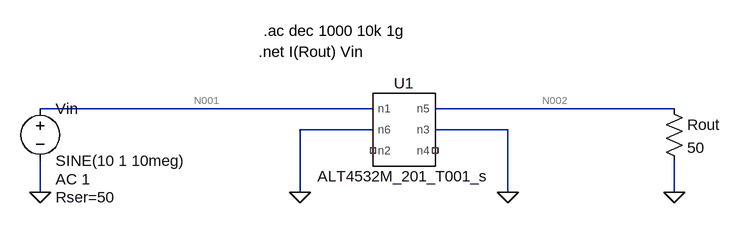
[diagram p0: schematic ETH_trafo_S21.asc]
ETH_trafo_S21.asc, the LTspice schematic file:
Version 4
SHEET 1 880 680
WIRE -64 112 -576 112
WIRE 400 112 32 112
WIRE -64 144 -176 144
WIRE 144 144 32 144
WIRE -576 240 -576 192
WIRE -176 240 -176 144
WIRE 144 240 144 144
WIRE 400 240 400 192
FLAG -576 240 0
FLAG 400 240 0
FLAG -176 240 0
FLAG 144 240 0
DATAFLAG 288 112 ""
SYMBOL voltage -576 96 R0
WINDOW 123 24 124 Left 2
WINDOW 39 24 152 Left 2
SYMATTR Value2 AC 1
SYMATTR SpiceLine Rser=50
SYMATTR InstName Vin
SYMATTR Value SINE(10 1 10meg)
SYMBOL res 384 96 R0
SYMATTR InstName Rout
SYMATTR Value 50
SYMBOL AutoGenerated\\ALT4532M_201_T001_s -16 144 R0
SYMATTR InstName U1
TEXT -240 24 Left 2 !.net I(Rout) Vin
TEXT -232 -8 Left 2 !.ac dec 1000 10k 1g

The netlist it stands for:
* ETH_trafo_S21.asc
Vin N001 0 SINE(10 1 10meg) AC 1 Rser=50
Rout N002 0 50
XU1 N001 NC_01 0 NC_02 N002 0 ALT4532M_201_T001_s  ; pins n1 n2 n3 n4 n5 n6
.net I(Rout) Vin
.ac dec 1000 10k 1g
.lib alt4532m_201_t001_s.mod.cir
.backanno
.end

* Results of the author's LTspice run, read from the files saved beside the schematic
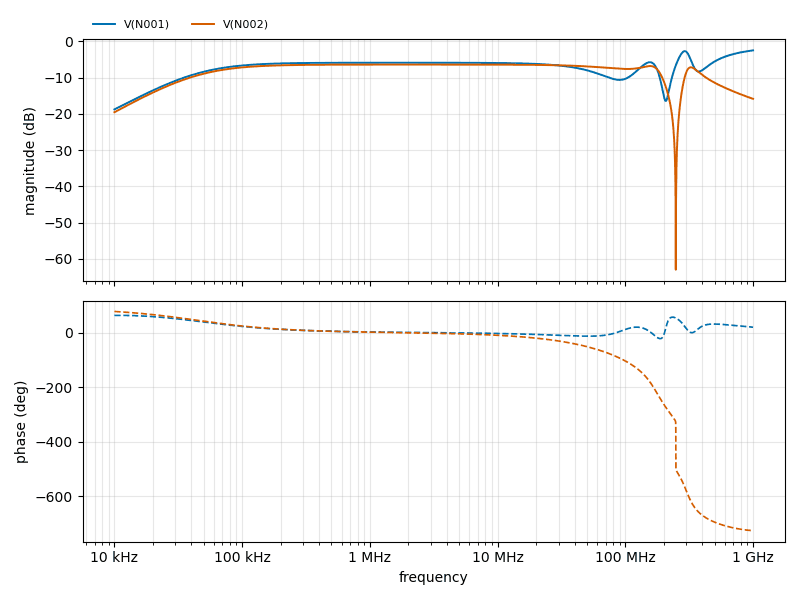
[diagram p1: AC Analysis of ETH_trafo_S21.asc, plotted from the saved traces]
* AC Analysis, 1 run:
*   V(N001): -18.77 dB at 10 kHz, -2.52 dB at 1 GHz, peak -2.52 dB at 1 GHz, 3 dB below the peak at 502.8 MHz
*   V(N002): -19.57 dB at 10 kHz, -15.87 dB at 1 GHz, peak -6.43 dB at 2.477 MHz, 3 dB below the peak at 44.26 kHz and 190.8 MHz